# Altium project HappyNewYear.PrjPcb
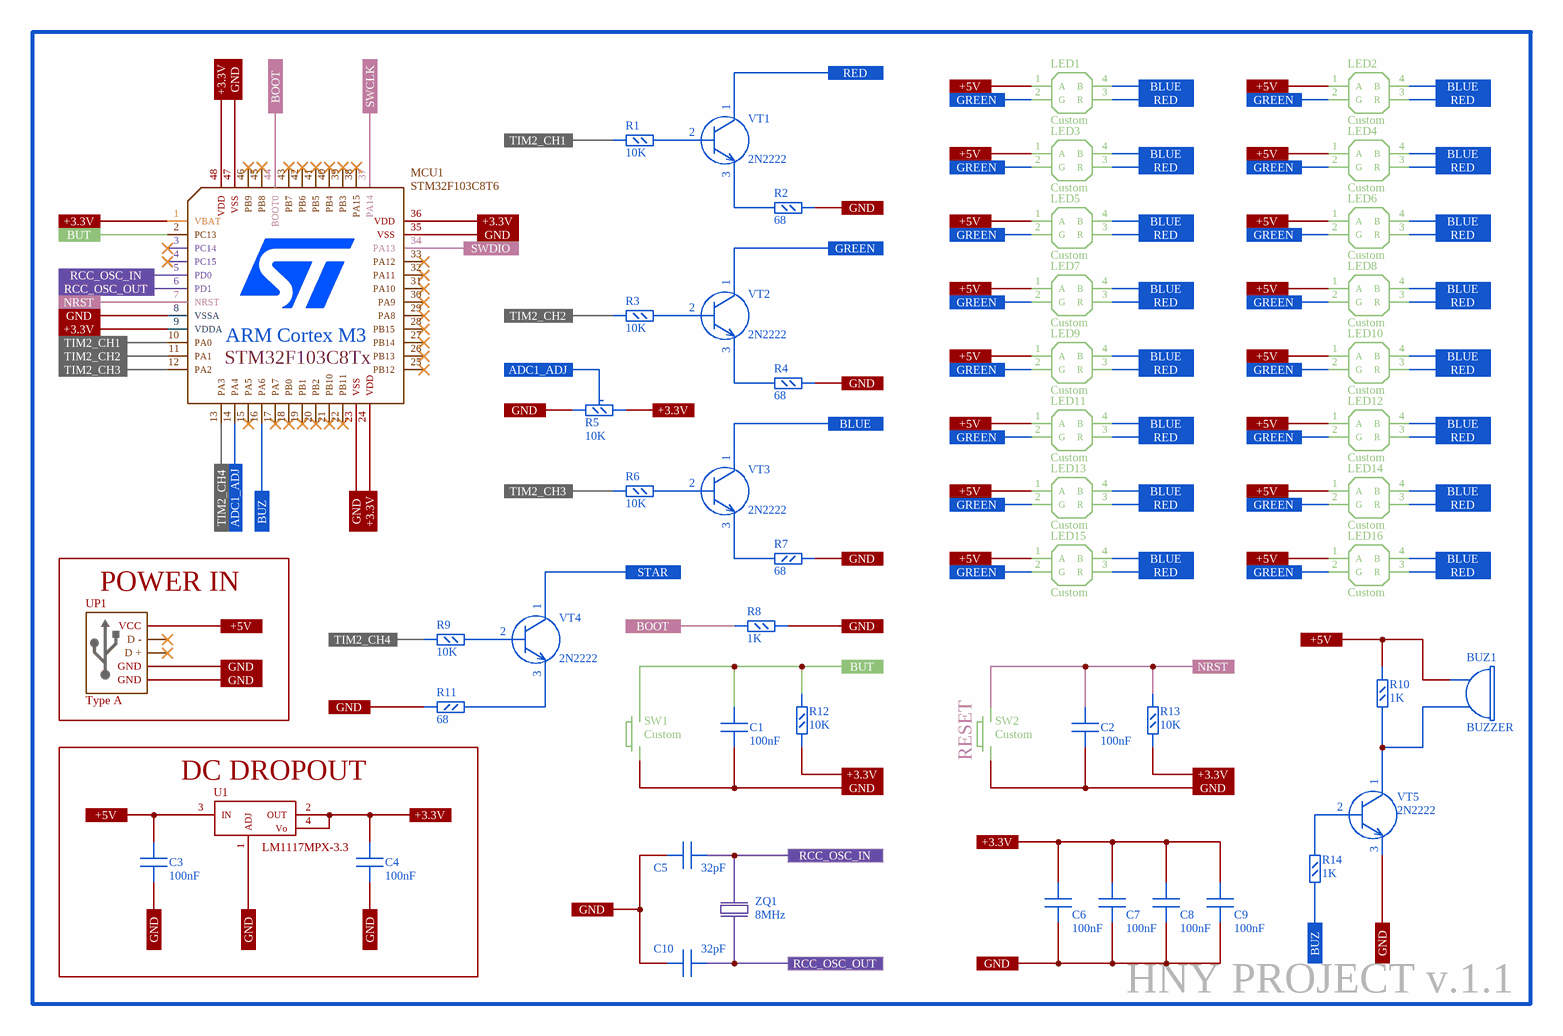
[diagram p0: SheetSCH.SchDoc]
1 sheet, 52 parts. Net scope: flat (ports and power ports of the same name join across sheets).
Board files: Part1_PCB.PcbDoc, Part2_PCB.PcbDoc, MotherBoardPCB.PcbDoc

## Sheet SheetSCH.SchDoc
size A4; SheetNumber: 1; SheetTotal: 1

### Parts
BUZ1  BUZZER  [BUZZER-5.08MM-D10.5MM]
C1  100nF  [C0603]
C2  100nF  [C0603]
C3  100nF  [C0805]
C4  100nF  [C0805]
C5  32pF  [C0603]
C6  100nF  [C0603]
C7  100nF  [C0603]
C8  100nF  [C0603]
C9  100nF  [C0603]
C10  32pF  [C0603]
LED1  Custom  [LED_RGB_2_LAYERS]
LED2  Custom  [LED_RGB_2_LAYERS]
LED3  Custom  [LED_RGB_2_LAYERS]
LED4  Custom  [LED_RGB_2_LAYERS]
LED5  Custom  [LED_RGB_2_LAYERS]
LED6  Custom  [LED_RGB_2_LAYERS]
LED7  Custom  [LED_RGB_2_LAYERS]
LED8  Custom  [LED_RGB_2_LAYERS]
LED9  Custom  [LED_RGB_2_LAYERS]
LED10  Custom  [LED_RGB_2_LAYERS]
LED11  Custom  [LED_RGB_2_LAYERS]
LED12  Custom  [LED_RGB_2_LAYERS]
LED13  Custom  [LED_RGB_2_LAYERS]
LED14  Custom  [LED_RGB_2_LAYERS]
LED15  Custom  [LED_RGB_2_LAYERS]
LED16  Custom  [LED_RGB_2_LAYERS]
MCU1  STM32F103C8T6  [LQFP48]
R1  10K  [R0603]
R2  68  [R1206]
R3  10K  [R0603]
R4  68  [R1206]
R5  10K  [EVM3]
R6  10K  [R0603]
R7  68  [R1206]
R8  1K  [R0603]
R9  10K  [R0603]
R10  1K  [R0603]
R11  68  [R1206]
R12  10K  [R0603]
R13  10K  [R0603]
R14  1K  [R0603]
SW1  Custom  [BUT-6.5X4.5MM]
SW2  Custom  [BUT-6.5X4.5MM]
U1  LM1117MPX-3.3  [SOT-223]
UP1  Type A  [USB-MICRO-F]
VT1  2N2222  [SOT-23-123]
VT2  2N2222  [SOT-23-123]
VT3  2N2222  [SOT-23-123]
VT4  2N2222  [SOT-23-123]
VT5  2N2222  [SOT-23-123]
ZQ1  8MHz  [HC-49]

### Blocks framed on the sheet
POWER IN: UP1
DC DROPOUT: C3 C4 U1

### Ports
+3.3V, +5V, ADC1_ADJ, BLUE, BOOT, BUT, BUZ, GND, GREEN, NRST, RCC_OSC_IN, RCC_OSC_OUT, RED, STAR, SWCLK, SWDIO, TIM2_CH1, TIM2_CH2, TIM2_CH3, TIM2_CH4

### Nets
+3.3V: C4.2 C6.2 C7.2 C8.2 C9.2 MCU1.1(VBAT) MCU1.9(VDDA) MCU1.24(VDD) MCU1.36(VDD) MCU1.48(VDD) R5.3 R12.2 R13.2 U1.2(OUT) U1.4(Vo) ; port +3.3V
+5V: BUZ1.1 C3.2 LED1.1(A) LED2.1(A) LED3.1(A) LED4.1(A) LED5.1(A) LED6.1(A) LED7.1(A) LED8.1(A) LED9.1(A) LED10.1(A) LED11.1(A) LED12.1(A) LED13.1(A) LED14.1(A) LED15.1(A) LED16.1(A) R10.1 U1.3(IN) UP1.1(VCC) ; port +5V
ADC1_ADJ: MCU1.14(PA4) R5.2 ; port ADC1_ADJ
BLUE: LED1.4(B) LED2.4(B) LED3.4(B) LED4.4(B) LED5.4(B) LED6.4(B) LED7.4(B) LED8.4(B) LED9.4(B) LED10.4(B) LED11.4(B) LED12.4(B) LED13.4(B) LED14.4(B) LED15.4(B) LED16.4(B) VT3.1 ; port BLUE
BOOT: MCU1.44(BOOT0) R8.1 ; port BOOT
BUT: C1.2 MCU1.2(PC13) R12.1 SW1.3(Q2) ; port BUT
BUZ: MCU1.16(PA6) R14.1 ; port BUZ
GND: C1.1 C2.1 C3.1 C4.1 C5.2 C6.1 C7.1 C8.1 C9.1 C10.2 MCU1.8(VSSA) MCU1.23(VSS) MCU1.35(VSS) MCU1.47(VSS) R2.2 R4.2 R5.1 R7.2 R8.2 R11.2 SW1.1(Q1) SW2.1(Q1) U1.1(ADJ) UP1.4(GND) UP1.5(GND) VT5.3 ; port GND
GREEN: LED1.2(G) LED2.2(G) LED3.2(G) LED4.2(G) LED5.2(G) LED6.2(G) LED7.2(G) LED8.2(G) LED9.2(G) LED10.2(G) LED11.2(G) LED12.2(G) LED13.2(G) LED14.2(G) LED15.2(G) LED16.2(G) VT2.1 ; port GREEN
NRST: C2.2 MCU1.7(NRST) R13.1 SW2.3(Q2) ; port NRST
RCC_OSC_IN: C5.1 MCU1.5(PD0) ZQ1.1 ; port RCC_OSC_IN
RCC_OSC_OUT: C10.1 MCU1.6(PD1) ZQ1.2 ; port RCC_OSC_OUT
RED: LED1.3(R) LED2.3(R) LED3.3(R) LED4.3(R) LED5.3(R) LED6.3(R) LED7.3(R) LED8.3(R) LED9.3(R) LED10.3(R) LED11.3(R) LED12.3(R) LED13.3(R) LED14.3(R) LED15.3(R) LED16.3(R) VT1.1 ; port RED
STAR: VT4.1 ; port STAR
SWCLK: MCU1.37(PA14) ; port SWCLK
SWDIO: MCU1.34(PA13) ; port SWDIO
TIM2_CH1: MCU1.10(PA0) R1.1 ; port TIM2_CH1
TIM2_CH2: MCU1.11(PA1) R3.1 ; port TIM2_CH2
TIM2_CH3: MCU1.12(PA2) R6.1 ; port TIM2_CH3
TIM2_CH4: MCU1.13(PA3) R9.1 ; port TIM2_CH4
NetBUZ1_2: BUZ1.2 R10.2 VT5.1
NetR1_2: R1.2 VT1.2
NetR2_1: R2.1 VT1.3
NetR3_2: R3.2 VT2.2
NetR4_1: R4.1 VT2.3
NetR6_2: R6.2 VT3.2
NetR7_1: R7.1 VT3.3
NetR9_2: R9.2 VT4.2
NetR11_1: R11.1 VT4.3
NetR14_2: R14.2 VT5.2

Not connected (* = marked no-connect by the designer): MCU1 3(PC14)* 4(PC15)* 15(PA5)* 17(PA7)* 18(PB0)* 19(PB1)* 20(PB2)* 21(PB10)* 22(PB11)* 25(PB12)* 26(PB13)* 27(PB14)* 28(PB15)* 29(PA8)* 30(PA9)* 31(PA10)* 32(PA11)* 33(PA12)* 38(PA15)* 39(PB3)* 40(PB4)* 41(PB5)* 42(PB6)* 43(PB7)* 45(PB8)* 46(PB9)*; SW1 2(Q1) 4(Q2); SW2 2(Q1) 4(Q2); UP1 2(D_-)* 3(D_+)*

### Notes on the sheet
- (near SW2) RESET
- HNY PROJECT v.1.1
- (in symbol STM32F103C8Tx) ARM Cortex M3

### Library data of the parts
C1-C10 = Cap
  C1-C4 C6-C9: Value: 100nF
  C5 C10: Value: 32pF
LED1-LED16 = LED-RGB: Name: Custom
MCU1 = STM32F103C8Tx: Name: STM32F103C8T6
R1-R4 R6-R14 = Res
  R1 R3 R6 R9 R12 R13: Value: 10K
  R2 R4 R7 R11: Value: 68
  R8 R10 R14: Value: 1K
R5 = Res Adj: Value: 10K
SW1 SW2 = Button: Name: Custom
U1 = LM1117: Name: LM1117MPX-3.3
UP1 = USB: Type: Type A
VT1-VT5 = NPN_CBE: Name: 2N2222
ZQ1 = Crystall: Name: HC49SM; Value: 8MHz
BUZ1 = Buzzer: Name: BUZZER